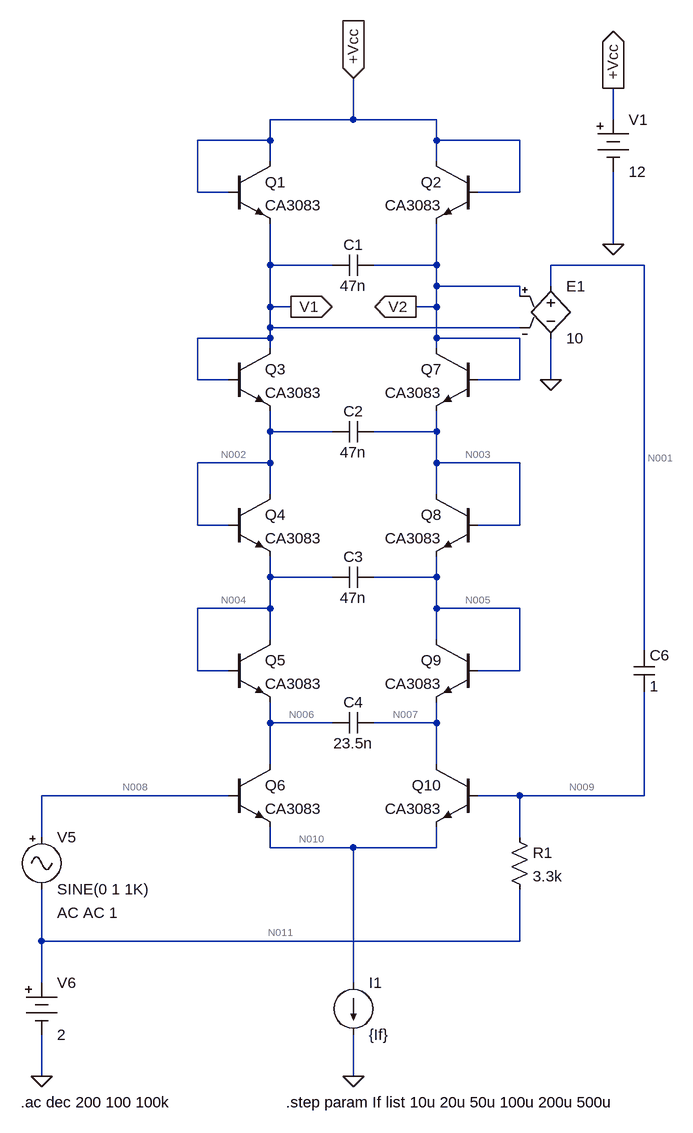
[diagram p0: schematic Moog Ladder Filter 2.asc]
Moog Ladder Filter 2.asc, the LTspice schematic file:
Version 4
SHEET 1 932 1576
WIRE 0 48 0 -16
WIRE 0 48 -128 48
WIRE 128 48 0 48
WIRE 400 48 400 0
WIRE -128 80 -128 48
WIRE -128 80 -240 80
WIRE 128 80 128 48
WIRE 256 80 128 80
WIRE -128 112 -128 80
WIRE 128 112 128 80
WIRE -240 160 -240 80
WIRE -192 160 -240 160
WIRE 256 160 256 80
WIRE 256 160 192 160
WIRE 400 240 400 128
WIRE -128 272 -128 208
WIRE -32 272 -128 272
WIRE 128 272 128 208
WIRE 128 272 32 272
WIRE 448 272 304 272
WIRE 128 304 128 272
WIRE 256 304 128 304
WIRE 304 304 304 272
WIRE 256 320 256 304
WIRE -128 336 -128 272
WIRE -96 336 -128 336
WIRE 128 336 128 304
WIRE 128 336 96 336
WIRE -128 368 -128 336
WIRE 256 368 -128 368
WIRE -128 384 -128 368
WIRE -128 384 -240 384
WIRE 128 384 128 336
WIRE 256 384 128 384
WIRE -128 400 -128 384
WIRE 128 400 128 384
WIRE -240 448 -240 384
WIRE -192 448 -240 448
WIRE 256 448 256 384
WIRE 256 448 192 448
WIRE 304 448 304 384
WIRE -128 528 -128 496
WIRE -32 528 -128 528
WIRE 128 528 128 496
WIRE 128 528 32 528
WIRE -128 576 -128 528
WIRE -128 576 -240 576
WIRE 128 576 128 528
WIRE 256 576 128 576
WIRE -128 624 -128 576
WIRE 128 624 128 576
WIRE -240 672 -240 576
WIRE -192 672 -240 672
WIRE 256 672 256 576
WIRE 256 672 192 672
WIRE -128 752 -128 720
WIRE -32 752 -128 752
WIRE 128 752 128 720
WIRE 128 752 32 752
WIRE -128 800 -128 752
WIRE -128 800 -240 800
WIRE 128 800 128 752
WIRE 256 800 128 800
WIRE -128 848 -128 800
WIRE 128 848 128 800
WIRE 448 864 448 272
WIRE -240 896 -240 800
WIRE -192 896 -240 896
WIRE 256 896 256 800
WIRE 256 896 192 896
WIRE -128 976 -128 944
WIRE -32 976 -128 976
WIRE 128 976 128 944
WIRE 128 976 32 976
WIRE -128 1040 -128 976
WIRE 128 1040 128 976
WIRE -192 1088 -480 1088
WIRE 256 1088 192 1088
WIRE 448 1088 448 928
WIRE 448 1088 256 1088
WIRE -480 1152 -480 1088
WIRE 256 1152 256 1088
WIRE -128 1168 -128 1136
WIRE 0 1168 -128 1168
WIRE 128 1168 128 1136
WIRE 128 1168 0 1168
WIRE -480 1312 -480 1232
WIRE 256 1312 256 1232
WIRE 256 1312 -480 1312
WIRE -480 1376 -480 1312
WIRE 0 1376 0 1168
WIRE -480 1520 -480 1456
WIRE 0 1520 0 1456
FLAG 400 0 +Vcc
IOPIN 400 0 Out
FLAG 400 240 0
FLAG 0 -16 +Vcc
IOPIN 0 -16 In
FLAG -96 336 V1
IOPIN -96 336 Out
FLAG 96 336 V2
IOPIN 96 336 Out
FLAG -480 1520 0
FLAG 0 1520 0
FLAG 304 448 0
SYMBOL e 304 288 R0
SYMATTR InstName E1
SYMATTR Value 10
SYMBOL npn -192 112 R0
SYMATTR InstName Q1
SYMATTR Value CA3083
SYMBOL npn 192 112 M0
SYMATTR InstName Q2
SYMATTR Value CA3083
SYMBOL Misc\\battery 400 32 R0
WINDOW 123 0 0 Left 0
WINDOW 39 0 0 Left 0
SYMATTR InstName V1
SYMATTR Value 12
SYMBOL cap 32 256 R90
WINDOW 0 0 32 VBottom 2
WINDOW 3 32 32 VTop 2
SYMATTR InstName C1
SYMATTR Value 47n
SYMBOL cap -32 544 R270
WINDOW 0 32 32 VTop 2
WINDOW 3 0 32 VBottom 2
SYMATTR InstName C2
SYMATTR Value 47n
SYMBOL cap -32 768 R270
WINDOW 0 32 32 VTop 2
WINDOW 3 0 32 VBottom 2
SYMATTR InstName C3
SYMATTR Value 47n
SYMBOL cap -32 992 R270
WINDOW 0 32 32 VTop 2
WINDOW 3 0 32 VBottom 2
SYMATTR InstName C4
SYMATTR Value 23.5n
SYMBOL cap 432 864 R0
SYMATTR InstName C6
SYMATTR Value 1
SYMBOL res 240 1136 R0
SYMATTR InstName R1
SYMATTR Value 3.3k
SYMBOL Misc\\signal -480 1136 R0
WINDOW 123 24 132 Left 2
WINDOW 39 0 0 Left 0
SYMATTR Value2 AC AC 1
SYMATTR InstName V5
SYMBOL Misc\\battery -480 1360 R0
WINDOW 123 0 0 Left 0
WINDOW 39 0 0 Left 0
SYMATTR InstName V6
SYMATTR Value 2
SYMBOL current 0 1376 R0
WINDOW 123 0 0 Left 0
WINDOW 39 0 0 Left 0
SYMATTR InstName I1
SYMATTR Value {If}
SYMBOL npn -192 400 R0
SYMATTR InstName Q3
SYMATTR Value CA3083
SYMBOL npn -192 624 R0
SYMATTR InstName Q4
SYMATTR Value CA3083
SYMBOL npn -192 848 R0
SYMATTR InstName Q5
SYMATTR Value CA3083
SYMBOL npn -192 1040 R0
SYMATTR InstName Q6
SYMATTR Value CA3083
SYMBOL npn 192 400 M0
SYMATTR InstName Q7
SYMATTR Value CA3083
SYMBOL npn 192 624 M0
SYMATTR InstName Q8
SYMATTR Value CA3083
SYMBOL npn 192 848 M0
SYMATTR InstName Q9
SYMATTR Value CA3083
SYMBOL npn 192 1040 M0
SYMATTR InstName Q10
SYMATTR Value CA3083
TEXT -512 1560 Left 2 !.ac dec 200 100 100k
TEXT -104 1560 Left 2 !.step param If list 10u 20u 50u 100u 200u 500u

The netlist it stands for:
* Moog Ladder Filter 2.asc
E1 N001 0 V2 V1 10
Q1 +Vcc +Vcc V1 0 CA3083
Q2 +Vcc +Vcc V2 0 CA3083
V1 +Vcc 0 12
C1 V2 V1 47n
C2 N002 N003 47n
C3 N004 N005 47n
C4 N006 N007 23.5n
C6 N001 N009 1
R1 N009 N011 3.3k
V5 N008 N011 SINE(0 1 1K) AC AC 1
V6 N011 0 2
I1 N010 0 {If}
Q3 V1 V1 N002 0 CA3083
Q4 N002 N002 N004 0 CA3083
Q5 N004 N004 N006 0 CA3083
Q6 N006 N008 N010 0 CA3083
Q7 V2 V2 N003 0 CA3083
Q8 N003 N003 N005 0 CA3083
Q9 N005 N005 N007 0 CA3083
Q10 N007 N009 N010 0 CA3083
.model NPN NPN
.model PNP PNP
.lib standard.bjt
.ac dec 200 100 100k
.step param If list 10u 20u 50u 100u 200u 500u
.backanno
.end

* Results of the author's LTspice run, read from the files saved beside the schematic
* Operating Point (first step), zero values left out:
*   if = 10 µA
*   V(n001) = 39.87 mV
*   V(v2) = 11.5 V
*   V(v1) = 11.49 V
*   V(+vcc) = 12 V
*   V(n002) = 10.99 V
*   V(n003) = 11 V
*   V(n004) = 10.48 V
*   V(n005) = 10.5 V
*   V(n006) = 9.979 V
*   V(n007) = 9.995 V
*   V(n009) = 1.996 V
*   V(n011) = 2 V
*   V(n008) = 2 V
*   V(n010) = 1.489 V
*   Ic(Q1) = 3.034 µA
*   Ib(Q1) = 1.058 µA
*   Ie(Q1) = -4.092 µA
*   Ic(Q2) = 2.601 µA
*   Ib(Q2) = 947.3 nA
*   Ie(Q2) = -3.548 µA
*   Ic(Q3) = 3.034 µA
*   Ib(Q3) = 1.058 µA
*   Ie(Q3) = -4.092 µA
*   Ic(Q4) = 3.034 µA
*   Ib(Q4) = 1.058 µA
*   Ie(Q4) = -4.092 µA
*   Ic(Q5) = 3.034 µA
*   Ib(Q5) = 1.058 µA
*   Ie(Q5) = -4.092 µA
*   Ic(Q6) = 4.092 µA
*   Ib(Q6) = 1.24 µA
*   Ie(Q6) = -5.332 µA
*   Ic(Q7) = 2.601 µA
*   Ib(Q7) = 947.3 nA
*   Ie(Q7) = -3.548 µA
*   Ic(Q8) = 2.601 µA
*   Ib(Q8) = 947.3 nA
*   Ie(Q8) = -3.548 µA
*   Ic(Q9) = 2.601 µA
*   Ib(Q9) = 947.3 nA
*   Ie(Q9) = -3.548 µA
*   Ic(Q10) = 3.548 µA
*   Ib(Q10) = 1.12 µA
*   Ie(Q10) = -4.668 µA
*   I(C6) = -1.956 pA
*   I(I1) = 10 µA
*   I(R1) = -1.12 µA
*   I(E1) = 1.956 pA
*   I(V1) = -7.64 µA
*   I(V5) = -1.24 µA
*   I(V6) = -2.36 µA
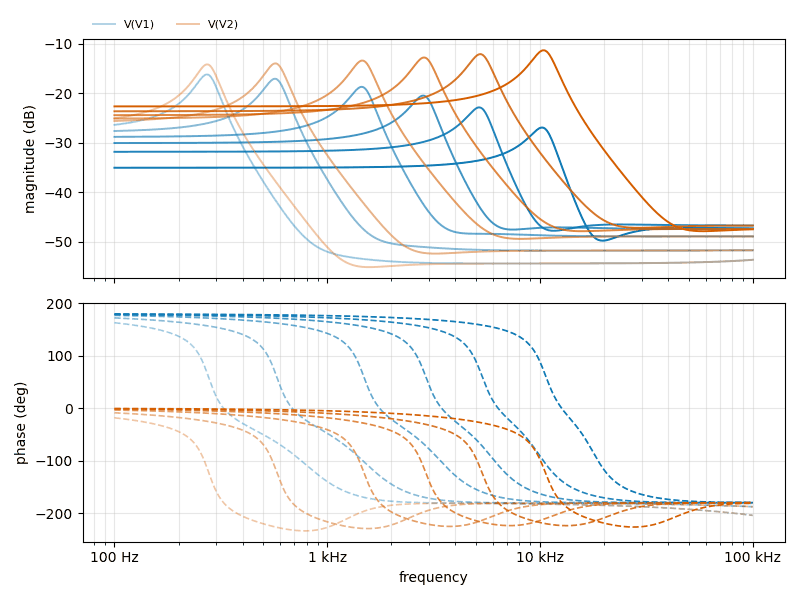
[diagram p1: AC Analysis of Moog Ladder Filter 2.asc, plotted from the saved traces]
* AC Analysis, 6 runs:
*   V(V1) [if=1e-05]: -26.40 dB at 100 Hz, -53.61 dB at 100 kHz, peak -16.23 dB at 272.3 Hz, 3 dB below the peak at 233.7 Hz and 303.8 Hz
*   V(V1) [if=2e-05]: -27.64 dB at 100 Hz, -51.68 dB at 100 kHz, peak -17.10 dB at 568.9 Hz, 3 dB below the peak at 484.2 Hz and 636.1 Hz
*   V(V1) [if=5e-05]: -28.82 dB at 100 Hz, -48.88 dB at 100 kHz, peak -18.73 dB at 1.445 kHz, 3 dB below the peak at 1.225 kHz and 1.63 kHz
*   V(V1) [if=0.0001]: -30.06 dB at 100 Hz, -47.37 dB at 100 kHz, peak -20.50 dB at 2.818 kHz, 3 dB below the peak at 2.362 kHz and 3.175 kHz
*   V(V1) [if=0.0002]: -31.83 dB at 100 Hz, -46.68 dB at 100 kHz, peak -22.87 dB at 5.188 kHz, 3 dB below the peak at 4.283 kHz and 5.821 kHz
*   V(V1) [if=0.0005]: -35.05 dB at 100 Hz, -47.27 dB at 100 kHz, peak -26.94 dB at 10.23 kHz, 3 dB below the peak at 8.314 kHz and 11.49 kHz
*   V(V2) [if=1e-05]: -25.07 dB at 100 Hz, -53.61 dB at 100 kHz, peak -14.20 dB at 272.3 Hz, 3 dB below the peak at 235.5 Hz and 305.1 Hz
*   V(V2) [if=2e-05]: -25.61 dB at 100 Hz, -51.68 dB at 100 kHz, peak -14.00 dB at 568.9 Hz, 3 dB below the peak at 490.1 Hz and 640 Hz
*   V(V2) [if=5e-05]: -25.12 dB at 100 Hz, -48.88 dB at 100 kHz, peak -13.43 dB at 1.462 kHz, 3 dB below the peak at 1.249 kHz and 1.645 kHz
*   V(V2) [if=0.0001]: -24.44 dB at 100 Hz, -47.38 dB at 100 kHz, peak -12.81 dB at 2.851 kHz, 3 dB below the peak at 2.43 kHz and 3.216 kHz
*   V(V2) [if=0.0002]: -23.66 dB at 100 Hz, -46.70 dB at 100 kHz, peak -12.14 dB at 5.248 kHz, 3 dB below the peak at 4.453 kHz and 5.919 kHz
*   V(V2) [if=0.0005]: -22.68 dB at 100 Hz, -47.46 dB at 100 kHz, peak -11.36 dB at 10.35 kHz, 3 dB below the peak at 8.806 kHz and 11.76 kHz